# Altium schematic sheet 02_SRAD_Avionics.SchDoc
size A4; DocumentNumber: 2; SheetNumber: 2; SheetTotal: 4
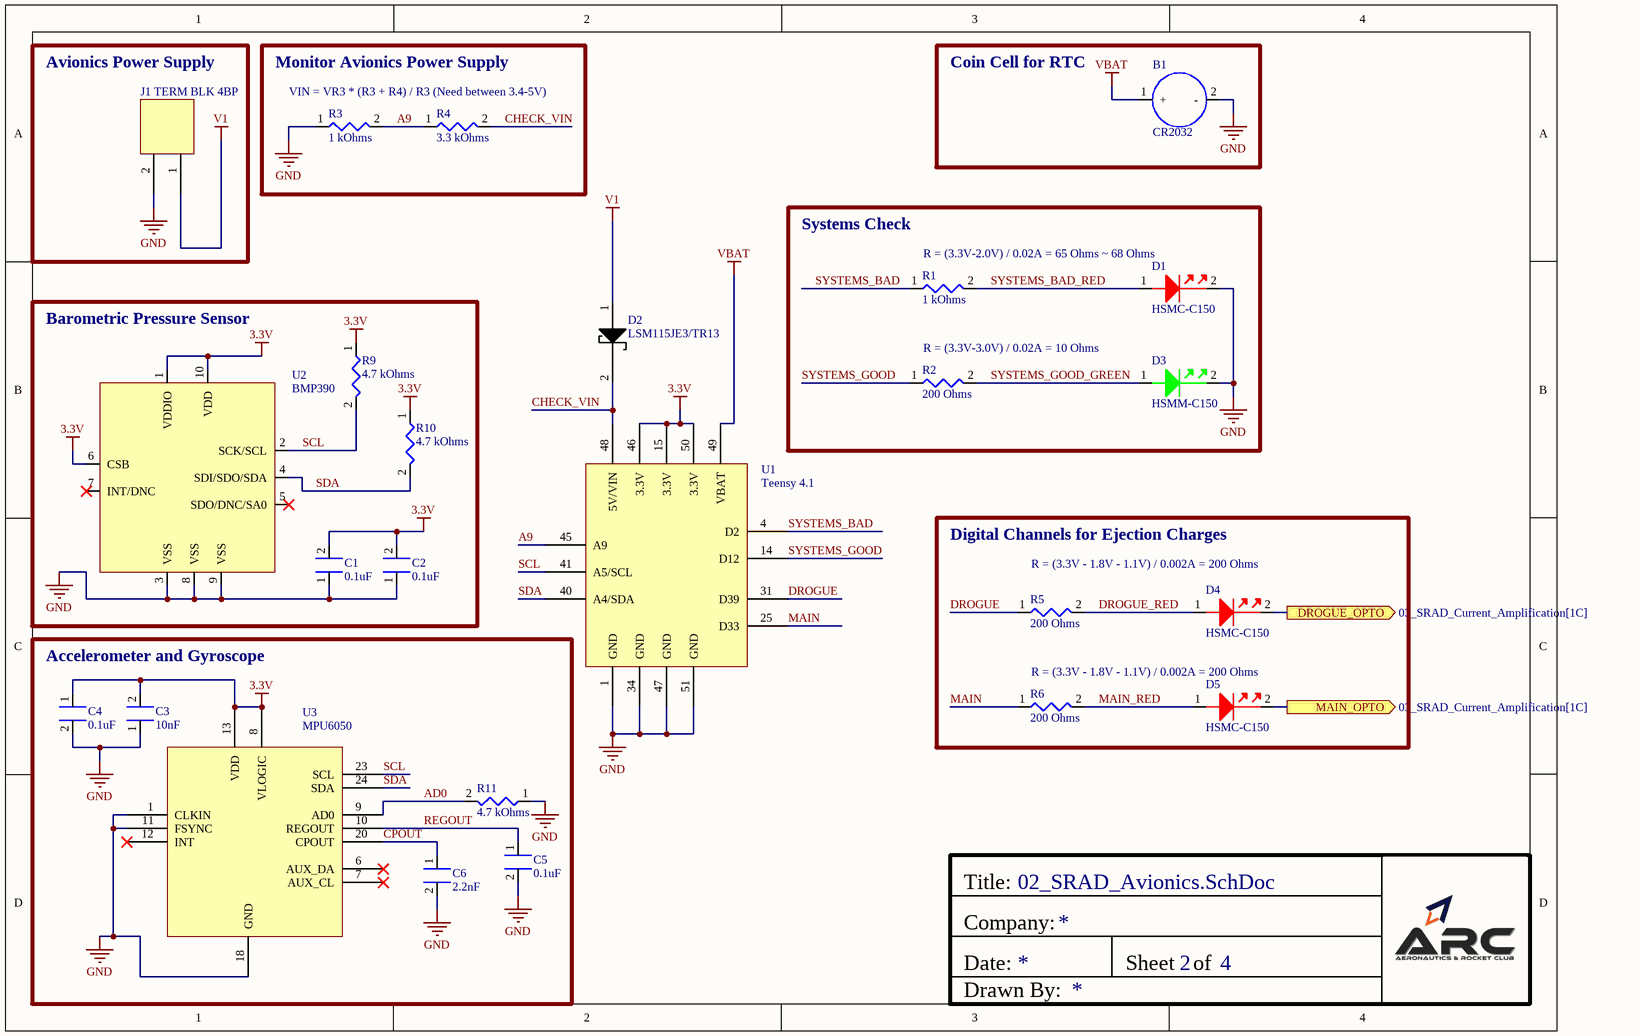
[diagram p0: 02_SRAD_Avionics.SchDoc]

## Parts
B1  CR2032  [CR2032]
C1  0.1uF  [CAPC2012X14N_1_35mm_HEIGHT]
C2  0.1uF  [CAPC2012X14N_1_35mm_HEIGHT]
C3  10nF  [CAPC2012X07N_06mmHEIGHT]
C4  0.1uF  [CAPC2012X14N_1_35mm_HEIGHT]
C5  0.1uF  [CAPC2012X14N_1_35mm_HEIGHT]
C6  2.2nF  [CAPC2012X07N_06mmHEIGHT]
D1  HSMC-C150  [DIOM3216X12N RED]
D2  LSM115JE3/TR13  [DIOM4336X33N]
D3  HSMM-C150  [DIOM3216X12N GREEN]
D4  HSMC-C150  [DIOM3216X12N RED]
D5  HSMC-C150  [DIOM3216X12N RED]
J1  TERM BLK 4BP  [PCB TERM BLK 2P 2.54MM]
R1  1 kOhms  [RESC2012X06N]
R2  200 Ohms  [RESC2012X06N]
R3  1 kOhms  [RESC2012X06N]
R4  3.3 kOhms  [RESC2012X06N]
R5  200 Ohms  [RESC2012X06N]
R6  200 Ohms  [RESC2012X06N]
R9  4.7 kOhms  [RESC2012X06N]
R10  4.7 kOhms  [RESC2012X06N]
R11  4.7 kOhms  [RESC2012X06N]
U1  Teensy 4.1  [Teensy 4.1]
U2  BMP390  [BMP390]
U3  MPU6050  [MPU6050]

## Blocks framed on the sheet
Avionics Power Supply: J1
Monitor Avionics Power Supply: R3 R4
Coin Cell for RTC: B1
Systems Check: D1 D3 R1 R2
Barometric Pressure Sensor: C1 C2 R9 R10 U2
Digital Channels for Ejection Charges: D4 D5 R5 R6
Accelerometer and Gyroscope: C3-C6 R11 U3

## Ports
DROGUE_OPTO (out, see 03_SRAD_Current_Amplification[1C]), MAIN_OPTO (out, see 03_SRAD_Current_Amplification[1C])

## Nets
3.3V: C1.2 C2.2 C3.2 C4.1 R9.1 R10.1 U1.15(3.3V) U1.46(3.3V) U1.50(3.3V) U2.1(VDDIO) U2.6(CSB) U2.10(VDD) U3.8(VLOGIC) U3.13(VDD)
GND: B1.2(-) C1.1 C2.1 C3.1 C4.2 C5.2 C6.2 D1.2(-) D3.2(-) J1.2(-) R3.1 R11.1 U1.1(GND) U1.34(GND) U1.47(GND) U1.51(GND) U2.3(VSS) U2.8(VSS) U2.9(VSS) U3.1(CLKIN) U3.11(FSYNC) U3.18(GND)
V1: D2.1(+) J1.1(+)
VBAT: B1.1(+) U1.49(VBAT)
A9: R3.2 R4.1 U1.45(A9)
AD0: R11.2 U3.9(AD0)
CHECK_VIN: D2.2(-) R4.2 U1.48(5V/VIN)
CPOUT: C6.1 U3.20(CPOUT)
DROGUE: R5.1 U1.31(D39)
DROGUE_OPTO: D4.2(-) ; port DROGUE_OPTO
DROGUE_RED: D4.1(+) R5.2
MAIN: R6.1 U1.25(D33)
MAIN_OPTO: D5.2(-) ; port MAIN_OPTO
MAIN_RED: D5.1(+) R6.2
REGOUT: C5.1 U3.10(REGOUT)
SCL: R9.2 U1.41(A5/SCL) U2.2(SCK/SCL) U3.23(SCL)
SDA: R10.2 U1.40(A4/SDA) U2.4(SDI/SDO/SDA) U3.24(SDA)
SYSTEMS_BAD: R1.1 U1.4(D2)
SYSTEMS_BAD_RED: D1.1(+) R1.2
SYSTEMS_GOOD: R2.1 U1.14(D12)
SYSTEMS_GOOD_GREEN: D3.1(+) R2.2

Not connected (* = marked no-connect by the designer): U2 5(SDO/DNC/SA0)* 7(INT/DNC)*; U3 6(AUX_DA)* 7(AUX_CL)* 12(INT)*

## Notes on the sheet
- VIN = VR3 * (R3 + R4) / R3 (Need between 3.4-5V)
- R = (3.3V-2.0V) / 0.02A = 65 Ohms ~ 68 Ohms
- R = (3.3V-3.0V) / 0.02A = 10 Ohms
- R = (3.3V - 1.8V - 1.1V) / 0.002A = 200 Ohms
- Title:
- Company:
- Date:
- Sheet
- of
- Drawn By:

## Library data of the parts
B1 = CR2032: CR2032 Coin cell battery of 3V.
C1 C2 C4 C5 = CC0805JPX7R8BB104: Capacitor Multilayer Ceramic MLCC - SMD/SMT 25 V 0.1uF X7R 0805 5%; Manufacturer: Yageo; Supplier 1: Mouser; Manufacturer Part Number: CC0805JPX7R8BB104; RoHS: Yes; Category: Ceramic Capacitors; Stock 1: 164887; Pricing 1: 1=0.14000, 10=0.09400, 50=0.09400, 100=0.04800, 1000=0.02900, 10000=0.02300 (USD); RoHS Compliant: Yes; Supplier Part Number 1: 603-CC0805JPX7R8BB10
C3 = CC0805JRX7R9BB103: Capacitor Multilayer Ceramic MLCC - SMD/SMT 50V 10nF X7R 0805 5%; Manufacturer: Yageo; Dissipation Factor: 2.5%; Insulation Resistance: 10GR; Supplier 1: Mouser; Manufacturer Part Number: CC0805JRX7R9BB103; RoHS: Yes; Category: Ceramic Capacitors; Stock 1: 102180; Pricing 1: 1=0.12000, 10=0.05000, 50=0.05000, 100=0.04100, 1000=0.02400, 10000=0.01700 (USD); Mounting Technology: Surface Mount; Case/Package: 0805; Pins: 2; Case Code (Imperial): 0805; Case Code (Metric): 2012; Min Operating Temperature: -55°C; Max Operating Temperature: 125°C; Voltage Rating (DC): 50V; Tolerance: 5%; Packaging: Tape and Reel; Value: 10nF; Voltage Rating: 50V; Package Quantity: 4000; Dielectric: X7R; Termination: SMD/SMT; Resistor Type: Ceramic; Series: CC; Construction: Flat; Length: 2mm; Width: 0.049inch; Height: 0.6mm; Thickness: 0.071inch; Depth: 1.25mm; Radiation Hardening: No; Lead Free: Lead Free; Halogen Free: Halogen Free; RoHS Compliant: Yes; ComponentLink1URL: https://datasheet.ciiva.com/26862/getdatasheetpartid-251801-26862952.pdf?src-supplier=Verical; ComponentLink1Description: https://datasheet.ciiva.com/26862/getdatasheetpartid-251801-26862952.pdf?src-supplier=Verical; ComponentLink2URL: https://datasheet.ciiva.com/11583/upy-gphc-x7r-6-3v-to-50v-8-11583532.pdf?src-supplier=Avnet; ComponentLink2Description: https://datasheet.ciiva.com/11583/upy-gphc-x7r-6-3v-to-50v-8-11583532.pdf?src-supplier=Avnet; ComponentLink3URL: https://datasheet.ciiva.com/13385/upy-gphc-x7r-6-3v-to-50v-8-13385902.pdf?src-supplier=Mouser; ComponentLink3Description: https://datasheet.ciiva.com/13385/upy-gphc-x7r-6-3v-to-50v-8-13385902.pdf?src-supplier=Mouser; Supplier Part Number 1: 603-CC805JRX7R9BB103
C6 = CC0805JRX7R9BB222: Capacitor Multilayer Ceramic MLCC - SMD/SMT 50 V 2.2nF X7R 0805 5%; Manufacturer: Yageo; Voltage Rating: 50V; Supplier 1: Mouser; Manufacturer Part Number: CC0805JRX7R9BB222; RoHS: Yes; Category: Ceramic Capacitors; Stock 1: 8721; Pricing 1: 1=0.14000, 10=0.06300, 50=0.06300, 100=0.04600, 1000=0.02800, 10000=0.01700 (USD); Mounting Technology: Surface Mount; Case/Package: 0805; Case Code (Imperial): 0805; Case Code (Metric): 2012; Min Operating Temperature: -55°C; Max Operating Temperature: 125°C; Value: 2.2nF; Tolerance: 5%; Voltage Rating (DC): 50V; Packaging: Tape and Reel; Dielectric: X7R; Termination: SMD/SMT; Resistor Type: Ceramic; Series: CC; Length: 2mm; Width: 0.049inch; Height: 0.6mm; Thickness: 0.028inch; Depth: 1.25mm; Radiation Hardening: No; Lead Free: Lead Free; Halogen Free: Halogen Free; RoHS Compliant: Yes; ComponentLink1URL: https://datasheet.ciiva.com/5425/upy-gphc-x7r-6-3v-to-50v-8-12304-5425448.pdf?src-supplier=Mouser; ComponentLink1Description: https://datasheet.ciiva.com/5425/upy-gphc-x7r-6-3v-to-50v-8-12304-5425448.pdf?src-supplier=Mouser; ComponentLink2URL: https://datasheet.ciiva.com/11583/upy-gphc-x7r-6-3v-to-50v-8-11583549.pdf?src-supplier=Avnet; ComponentLink2Description: https://datasheet.ciiva.com/11583/upy-gphc-x7r-6-3v-to-50v-8-11583549.pdf?src-supplier=Avnet; ComponentLink3URL: https://datasheet.ciiva.com/26829/getdatasheetpartid-407633-26829532.pdf?src-supplier=Verical; ComponentLink3Description: https://datasheet.ciiva.com/26829/getdatasheetpartid-407633-26829532.pdf?src-supplier=Verical; Supplier Part Number 1: 603-CC805JRX7R9BB222
D1 D4 D5 = DIOM3216X12N RED: Red 626nm LED Indication - Discrete 1.9V 1206 (3216 Metric); Manufacturer: Broadcom Avago; Lens Color: White; Forward Current: 20mA; Luminous Intensity: 90mcd; Viewing Angle: 170°; Lens Style: Diffused,Colorless,Rectangular; Power Rating: 60mW; Lens Transparency: Diffused; Number of Elements: 1; Reverse Voltage: 5V; Supplier 1: Digi-Key; Manufacturer Part Number: HSMC-C150; RoHS: Yes; Category: LEDs; Stock 1: 24000; Pricing 1: 3000=0.18077, 6000=0.16871, 15000=0.16269, 30000=0.16028 (USD); Mounting Technology: Surface Mount; Case/Package: 1206; Pins: 2; Color: Red; Case Code (Metric): 3016; Case Code (Imperial): 1206; Min Operating Temperature: -40°C; Max Operating Temperature: 85°C; Forward Voltage: 1.9V; Packaging: Tape and Reel; Package Quantity: 1; Series: -; Illumination Color: Red; Wavelength: 626nm; Test Current: 20mA; Dominant Wavelength: 626nm; Power Dissipation: 60mW; Max Power Dissipation: 60mW; Number of LEDs: 1; Length: 3.2mm; Width: 1.6mm; Height: 1.1mm; Depth: 1.6mm; Radiation Hardening: No; RoHS Compliant: Yes; Reach SVHC Compliant: Yes; ComponentLink1URL: https://datasheet.ciiva.com/29281/180506-da-01-en-chip-led-hsmc-c150-rot-29281000.pdf?src-supplier=Conrad; ComponentLink1Description: https://datasheet.ciiva.com/29281/180506-da-01-en-chip-led-hsmc-c150-rot-29281000.pdf?src-supplier=Conrad; ComponentLink2URL: https://datasheet.ciiva.com/48430/hsmx-c110-170-190-191-150-eng-tds-48430136.pdf?src-supplier=Distrelec; ComponentLink2Description: https://datasheet.ciiva.com/48430/hsmx-c110-170-190-191-150-eng-tds-48430136.pdf?src-supplier=Distrelec; ComponentLink3URL: https://datasheet.ciiva.com/22656/80886-22656552.pdf?src-supplier=Element14; ComponentLink3Description: https://datasheet.ciiva.com/22656/80886-22656552.pdf?src-supplier=Element14; ComponentLink4URL: https://datasheet.ciiva.com/22656/80886-22656553.pdf?src-supplier=Element14; ComponentLink4Description: https://datasheet.ciiva.com/22656/80886-22656553.pdf?src-supplier=Element14; Supplier Part Number 1: 516-2825-2-ND
D2 = DIOM4336X33N Schottky Diode: Diode 15 V 1A Surface Mount DO-214BA 220mV dropout @1A 10mA leakage current @15V -55°C ~ 150°C Maximum surge current of 50A for 8.3ms; Manufacturer: Microchip; Supplier 1: Digi-Key; Manufacturer Part Number: LSM115JE3/TR13; RoHS: Yes; Category: Rectifier Diodes; Stock 1: 319959; Pricing 1: 3000=0.55500 (USD); Supplier Part Number 1: 150-LSM115JE3/TR13TR-ND
D3 = DIOM3216X12N GREEN: Green 525nm LED Indication - Discrete 3.3V 1206 (3216 Metric); Manufacturer: Broadcom Avago; Lens Color: White; Lens Style: Diffused,Colorless,Rectangular; Viewing Angle: 170°; Forward Current: 20mA; Power Rating: 78mW; Luminous Intensity: 120mcd; Lens Transparency: Diffused; Number of LEDs: 1; Reverse Voltage: 5V; Supplier 1: Digi-Key; Manufacturer Part Number: HSMM-C150; RoHS: Yes; Category: LEDs; Stock 1: 3000; Pricing 1: 3000=0.48083, 6000=0.46999, 15000=0.45914 (USD); Mounting Technology: Surface Mount; Case/Package: 1206; Pins: 2; Color: Green; Case Code (Imperial): 1206; Contact Plating: Gold; Min Operating Temperature: -40°C; Max Operating Temperature: 85°C; Packaging: Tape and Reel; Package Quantity: 3000; Illumination Color: Green; Forward Voltage: 3.3V; Test Current: 20mA; Dominant Wavelength: 525nm; Wavelength: 525nm; Max Power Dissipation: 78mW; Series: -; Length: 3.2mm; Width: 1.6mm; Height: 1.1mm; Lead Free: Lead Free; RoHS Compliant: Yes; ComponentLink1URL: http://components.arrow.com/part/dataview/2630207S7245440N7786?src-supplier=Arrow+Electronics; ComponentLink1Description: http://components.arrow.com/part/dataview/2630207S7245440N7786?src-supplier=Arrow+Electronics; ComponentLink2URL: https://docs.broadcom.com/docs/AV02-0592EN?src-supplier=Digi-Key; ComponentLink2Description: https://docs.broadcom.com/docs/AV02-0592EN?src-supplier=Digi-Key; ComponentLink3URL: http://www.avagotech.com/docs/AV02-0592EN?src-supplier=Avnet; ComponentLink3Description: http://www.avagotech.com/docs/AV02-0592EN?src-supplier=Avnet; ComponentLink4URL: http://www.avagotech.com/docs/AV02-0592EN?src-supplier=Mouser; ComponentLink4Description: http://www.avagotech.com/docs/AV02-0592EN?src-supplier=Mouser; ComponentLink5URL: http://www.farnell.com/datasheets/1804332.pdf?src-supplier=Element14; ComponentLink5Description: http://www.farnell.com/datasheets/1804332.pdf?src-supplier=Element14; Supplier Part Number 1: 516-HSMM-C150TR-ND
J1 = PCB TERM BLK 2P 2.54MM: 2 Position Wire to Board Terminal Block Horizontal with Board 0.100" (2.54mm) Through Hole 10A 150V 16-30 AWG 0.2 Nm M1.6 screw -40°C ~ 105°C; Manufacturer: TE Connectivity; Manufacturer Part Number: 282834-2; Plating: Brass,Steel; Number of Poles: 2; Gender: Male; Number of Levels: 1; Connector Type: Receptacle; Closed End: No (Without); Screwless Terminal Block: Yes (With); Wire Gauge (Max): 30AWG; Tail Length: 3.4mm; Approvals: UL; Supplier 1: Digi-Key; RoHS: Yes; Category: Terminal Blocks; Stock 1: 34508; Pricing 1: 1=1.95000, 10=1.47400, 25=1.36640, 50=1.22860, 100=1.19860, 250=1.04876, 500=0.95886, 1000=0.86896, 5000=0.76409 (USD); Mounting Technology: Through Hole; Contact Plating: Tin; Contact Material: Brass; Color: Green; Material: Nylon; Housing Color: Green; Housing Material: Polyamide; Min Operating Temperature: -40°C; Max Operating Temperature: 105°C; Number of Rows: 1; Max Voltage Rating (AC): 150V; Current Rating: 10A; Voltage Rating: 150V; Package Quantity: 300; Packaging: Bulk; Number of Positions: 2; Termination: Solder; Number of Positions Per Level: 2; Current: 10A; Voltage: 150V; Max Supply Voltage (AC): 150V; Number of Contacts: 2; Number of Circuits: 2; Orientation: Straight; Max Current Rating: 10A; Interlock: No (Without); Screw Flange: No (Without); Side Stackable: Yes (With); Series: Buchanan; Length: 5.54mm; Width: 6.5mm; Wire Gauge (Min): 30AWG; Wire/Cable Gauge: 30AWG; Pitch: 2.54mm; Thread Size: M1.6; Depth: 6.5mm; Radiation Hardening: No; ELV: Compliant; Lead Free: Lead Free; Flammability Rating: UL94 V-0; RoHS Compliant: Yes; ComponentLink1URL: https://datasheet.ciiva.com/16386/282834-2-16386363.pdf?src-supplier=Future+Electronics; ComponentLink1Description: https://datasheet.ciiva.com/16386/282834-2-16386363.pdf?src-supplier=Future+Electronics; ComponentLink2URL: https://datasheet.ciiva.com/30166/eng-cs-1308389-eurostyle-terminal-blocks-0607-30166974.pdf?src-supplier=Onlinecomponents.com; ComponentLink2Description: https://datasheet.ciiva.com/30166/eng-cs-1308389-eurostyle-terminal-blocks-0607-30166974.pdf?src-supplier=Onlinecomponents.com; ComponentLink3URL: https://datasheet.ciiva.com/14609/70086732-14609670.pdf?src-supplier=Allied+Electronics; ComponentLink3Description: https://datasheet.ciiva.com/14609/70086732-14609670.pdf?src-supplier=Allied+Electronics; ComponentLink4URL: https://datasheet.ciiva.com/15169/getdatasheetpartid-155864-15169558.pdf?src-supplier=Verical; ComponentLink4Description: https://datasheet.ciiva.com/15169/getdatasheetpartid-155864-15169558.pdf?src-supplier=Verical; ComponentLink5URL: https://datasheet.ciiva.com/3141/eng-cs-1308389-eurostyle-terminal-blocks-0607-3141115.pdf?src-supplier=Avnet; ComponentLink5Description: https://datasheet.ciiva.com/3141/eng-cs-1308389-eurostyle-terminal-blocks-0607-3141115.pdf?src-supplier=Avnet; Supplier Part Number 1: A98333-ND
R1 R3 = RC0805FR-7W1KL Yageo: 1 kOhms ±1% 0.25W, 1/4W Chip Resistor 0805 (2012 Metric) Moisture Resistant Thick Film; Manufacturer: Yageo; Value: 1kR; Supplier 1: Digi-Key; Manufacturer Part Number: RC0805FR-7W1KL; RoHS: Yes; Category: Chip SMD Resistors; Stock 1: 15000; Pricing 1: 5000=0.01838, 10000=0.01715, 25000=0.01629, 50000=0.01596, 125000=0.01562 (USD); Case/Package: 0805; Tolerance: 1%; RoHS Compliant: Yes; Supplier Part Number 1: 13-RC0805FR-7W1KLTR-ND
R2 R5 R6 = RC0805FR-7W200RL Yageo: 200 Ohms ±1% 0.25W, 1/4W Chip Resistor 0805 (2012 Metric) Moisture Resistant Thick Film; Manufacturer: Yageo; Supplier 1: Digi-Key; Manufacturer Part Number: RC0805FR-7W200RL; RoHS: No; Category: Resistors; Pricing 1: 5000=0.01838 (USD); Supplier Part Number 1: 13-RC0805FR-7W200RL-ND
R4 = RC0805FR-7W3K3L Yageo: 3.3 kOhms ±1% 0.25W, 1/4W Chip Resistor 0805 (2012 Metric) Moisture Resistant Thick Film; Manufacturer: Yageo; Supplier 1: Avnet; Manufacturer Part Number: RC0805FR-7W3K3L; RoHS: Yes; Category: Chip SMD Resistors; Pricing 1: 5000=0.00430, 10000=0.00424, 20000=0.00411 (USD); Supplier Part Number 1: RC0805FR-7W3K3L
R9-R11 = RC0805FR-7W4K7L Yageo: 4.7 kOhms ±1% 0.25W, 1/4W Chip Resistor 0805 (2012 Metric) Moisture Resistant Thick Film; Manufacturer: Yageo; Supplier 1: Digi-Key; Manufacturer Part Number: RC0805FR-7W4K7L; RoHS: Yes; Category: Chip SMD Resistors; Pricing 1: 5000=0.01838 (USD); RoHS Compliant: Yes; Supplier Part Number 1: 13-RC0805FR-7W4K7L-ND
U1 = Teensy 4.1: RT1062 Teensy 4.1 - ARM® Cortex®-M7 MCU 32-Bit Embedded Evaluation Board 600 MHz 100 mA RTC Built-in microSD Card reader Arduino IDE compatible; Manufacturer: SparkFun; Manufacturer Part Number: DEV-16996; Supplier 1: Digi-Key; RoHS: No; Category: Embedded Processors and Controllers; Stock 1: 300; Pricing 1: 1=31.88000 (USD); Supplier Part Number 1: 1568-DEV-16996-ND
U2 = BMP390: Barometric pressure sensor manufactured by Bosch.; Supplier: Rutrinik24; Supplier ID: ICENVI1363
U3 = MPU6050: Accelerometer and gyroscope 6 DOF sensor. GY-521 breakout board by HiLetgo and MPU6050 chip by Invensense.